# EAGLE design Radio Receiver (EAGLE 8.4.1)
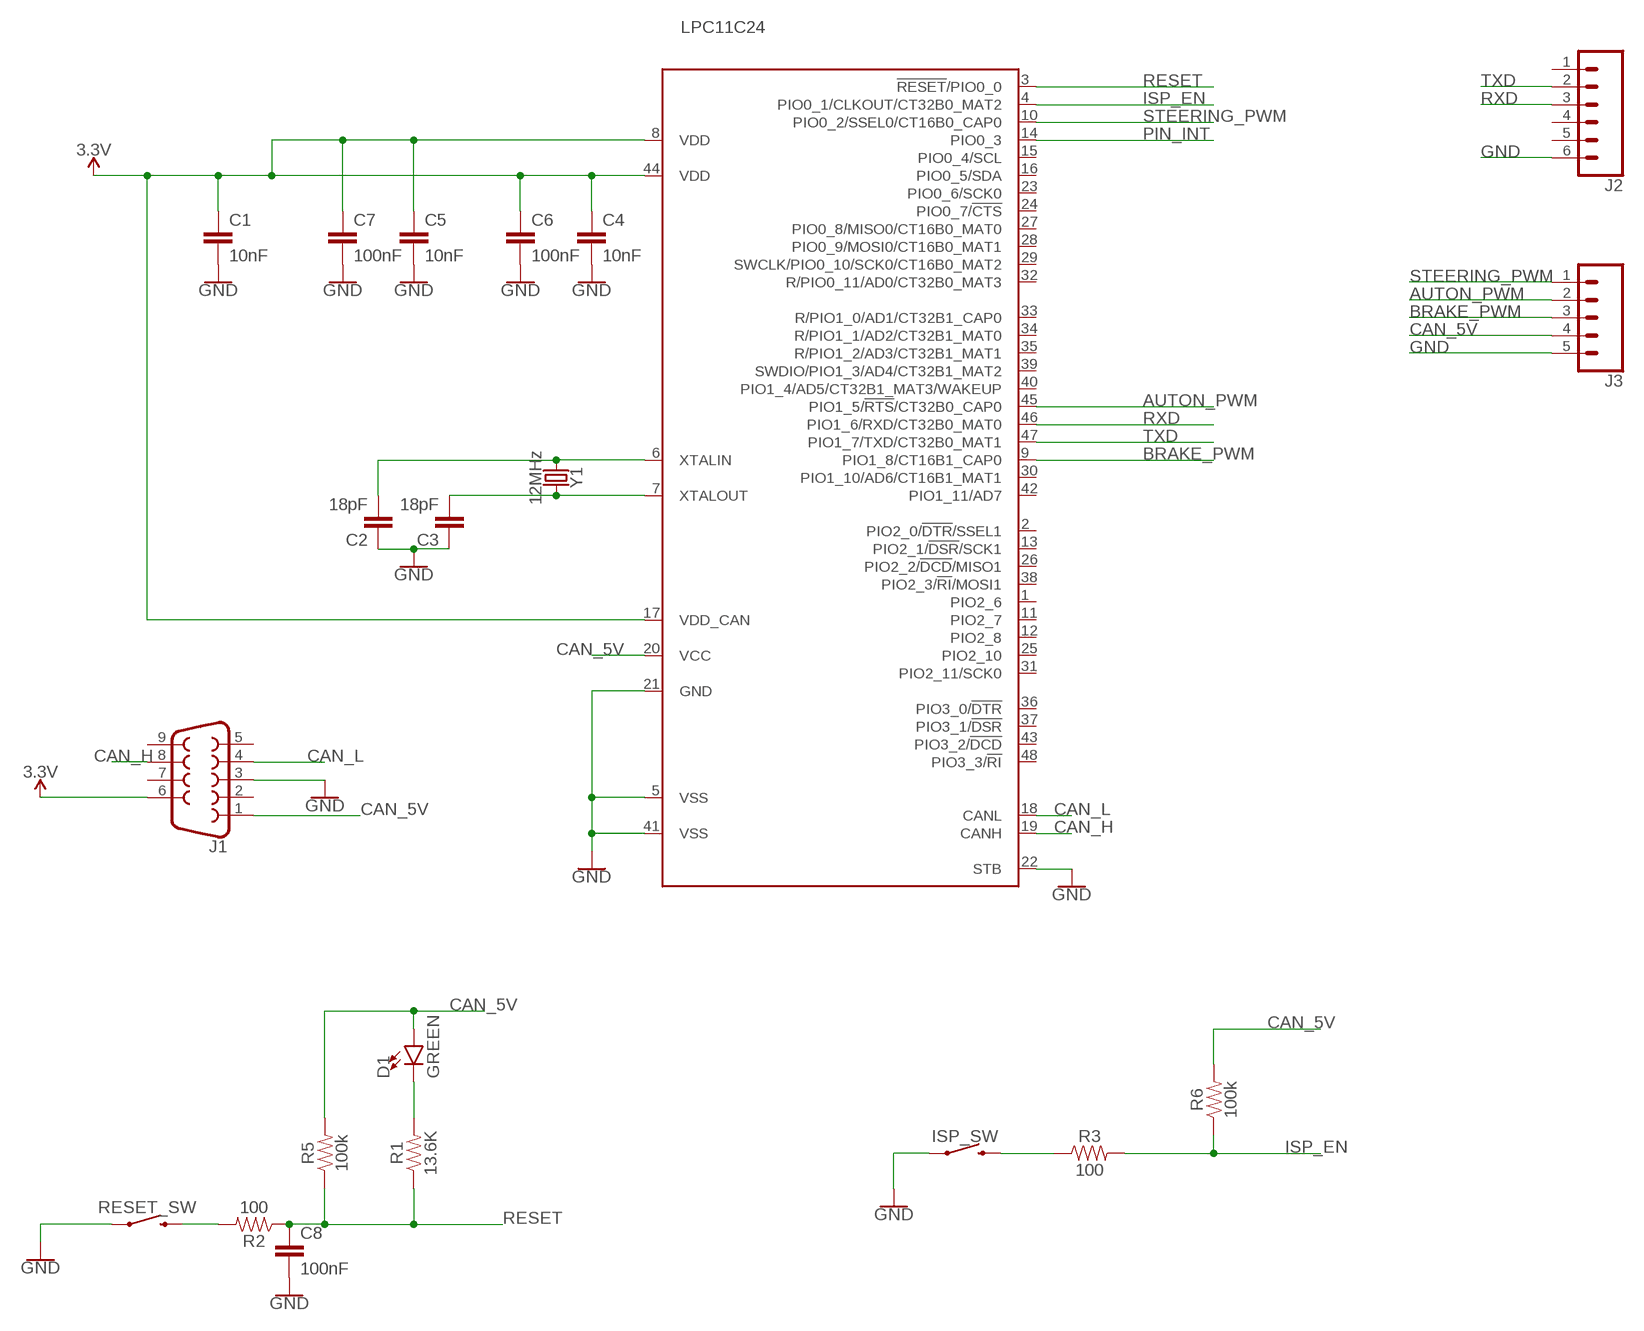
[diagram p0: schematic, sheet 1]

## Parts
C1  10nF  22PF-PTH-2.54MM-200V-5%  [CAP-PTH-2.54]
C2  18pF  22PF-PTH-2.54MM-200V-5%  [CAP-PTH-2.54]
C3  18pF  22PF-PTH-2.54MM-200V-5%  [CAP-PTH-2.54]
C4  10nF  22PF-PTH-2.54MM-200V-5%  [CAP-PTH-2.54]
C5  10nF  22PF-PTH-2.54MM-200V-5%  [CAP-PTH-2.54]
C6  100nF  22PF-PTH-2.54MM-200V-5%  [CAP-PTH-2.54]
C7  100nF  22PF-PTH-2.54MM-200V-5%  [CAP-PTH-2.54]
C8  100nF  22PF-PTH-2.54MM-200V-5%  [CAP-PTH-2.54]
D1  GREEN  LED-GREEN1206  [LED-1206]
ISP_SW  MOMENTARY-SWITCH-SPST-PTH-6.0MM  [TACTILE_SWITCH_PTH_6.0MM]
J1  DB9FEMALE  [DB9]
J2  CONN_06SILK_FEMALE_PTH  [1X06]
J3  CONN_05  [1X05]
LPC11C24  LPC11C22/24-LQFP48  [LQFP48]
R1  13.6K  100KOHM-HORIZ-1/4W-1%  [AXIAL-0.3]
R2  100  100KOHM-HORIZ-1/4W-1%  [AXIAL-0.3]
R3  100  100OHM-HORIZ-1/4W-1%  [AXIAL-0.3]
R5  100k  100KOHM-HORIZ-1/4W-1%  [AXIAL-0.3]
R6  100k  100KOHM-HORIZ-1/4W-1%  [AXIAL-0.3]
RESET_SW  MOMENTARY-SWITCH-SPST-PTH-6.0MM  [TACTILE_SWITCH_PTH_6.0MM]
Y1  12MHz  CRYSTAL-16MHZPTH-HC49US  [HC49US]

## Nets
3.3V: C1.1 C4.1 C5.1 C6.1 C7.1 J1.6 LPC11C24.8(VDD) LPC11C24.17(VDD_CAN) LPC11C24.44(VDD)
AUTON_PWM: J3.2 LPC11C24.45(PIO1_5/!RTS!/CT32B0_CAP0)
BRAKE_PWM: J3.3 LPC11C24.9(PIO1_8/CT16B1_CAP0)
CAN_5V: D1.A J1.1 J3.4 LPC11C24.20(VCC) R5.P$2 R6.P$2
CAN_H: J1.8 LPC11C24.19(CANH)
CAN_L: J1.4 LPC11C24.18(CANL)
GND: C1.2 C2.1 C3.1 C4.2 C5.2 C6.2 C7.2 C8.2 ISP_SW.1 J1.3 J2.6 J3.5 LPC11C24.5(VSS) LPC11C24.21(GND) LPC11C24.22(STB) LPC11C24.41(VSS) RESET_SW.1
ISP_EN: LPC11C24.4(PIO0_1/CLKOUT/CT32B0_MAT2) R3.P$2 R6.P$1
N$1: D1.C R1.P$2
N$2: R2.P$2 RESET_SW.3
N$4: ISP_SW.3 R3.P$1
PIN_INT: LPC11C24.14(PIO0_3)
RESET: C8.1 LPC11C24.3(!RESET!/PIO0_0) R1.P$1 R2.P$1 R5.P$1
RXD: J2.3 LPC11C24.46(PIO1_6/RXD/CT32B0_MAT0)
STEERING_PWM: J3.1 LPC11C24.10(PIO0_2/SSEL0/CT16B0_CAP0)
TXD: J2.2 LPC11C24.47(PIO1_7/TXD/CT32B0_MAT1)
XTALIN: C2.2 LPC11C24.6(XTALIN) Y1.1
XTALOUT: C3.2 LPC11C24.7(XTALOUT) Y1.2
Unconnected: J1.2 J1.5 J1.7 J1.9 J2.1 J2.4 J2.5 LPC11C24.1(PIO2_6) LPC11C24.2(PIO2_0/!DTR!/SSEL1) LPC11C24.11(PIO2_7) LPC11C24.12(PIO2_8) LPC11C24.13(PIO2_1/!DSR!/SCK1) LPC11C24.15(PIO0_4/SCL) LPC11C24.16(PIO0_5/SDA) LPC11C24.23(PIO0_6/SCK0) LPC11C24.24(PIO0_7/!CTS!) LPC11C24.25(PIO2_10) LPC11C24.26(PIO2_2/!DCD!/MISO1) LPC11C24.27(PIO0_8/MISO0/CT16B0_MAT0) LPC11C24.28(PIO0_9/MOSI0/CT16B0_MAT1) LPC11C24.29(SWCLK/PIO0_10/SCK0/CT16B0_MAT2) LPC11C24.30(PIO1_10/AD6/CT16B1_MAT1) LPC11C24.31(PIO2_11/SCK0) LPC11C24.32(R/PIO0_11/AD0/CT32B0_MAT3) LPC11C24.33(R/PIO1_0/AD1/CT32B1_CAP0) LPC11C24.34(R/PIO1_1/AD2/CT32B1_MAT0) LPC11C24.35(R/PIO1_2/AD3/CT32B1_MAT1) LPC11C24.36(PIO3_0/!DTR!) LPC11C24.37(PIO3_1/!DSR!) LPC11C24.38(PIO2_3/!RI!/MOSI1) LPC11C24.39(SWDIO/PIO1_3/AD4/CT32B1_MAT2) LPC11C24.40(PIO1_4/AD5/CT32B1_MAT3/WAKEUP) LPC11C24.42(PIO1_11/AD7) LPC11C24.43(PIO3_2/!DCD!) LPC11C24.48(PIO3_3/!RI!)

## Library data of the parts
C1-C8 = SparkFun-Capacitors:22PF: 22pF ceramic capacitors A capacitor is a passive two-terminal electrical component used to store electrical energy temporarily in an electric field.; PROD_ID: CAP-09128; VALUE: 22pF
D1 = SparkFun-LED:LED-GREEN: Green SMD LED Used in manufacturing of various products at SparkFun Packages: 0603 - SMD 0603 package [Product Link] <http://www.futureelectronics.com/en/technologies/semiconductors/optoelectronics/leds/Pages/9894312-LTST-C190GKT.aspx?CrossPart=HSMG-C190&IM=0> LilyPad 1206 - SMD1206 LilyPad package [Product Link] <http://www.futureelectronics.com/en/Technologies/Product.aspx?ProductID=IN150NGHARVATEKCORPORATION2049943&IM=0> 1206 - SMD1206 package [Product Link] <http://www.futureelectronics.com/en/technologies/semiconductors/optoelectronics/leds/Pages/8315665-LTST-C150KGKT.aspx?IM=0> 1206 Bottom Mount -SMD 1206 Bottom Mount [Product Link] <http://www.digikey.com/product-detail/en/lite-on-inc/LTST-C230KGKT/160-1456-1-ND/386854> SparkFun Products: Pro Mini 328 -5V <https://www.sparkfun.com/products/821> RedBoard <https://www.sparkfun.com/products/12757> MP3 Trigger <https://www.sparkfun.com/products/13720> Makey Makey <https://www.sparkfun.com/products/11076>; PROD_ID: DIO-00862
ISP_SW RESET_SW = SparkFun-Switches:MOMENTARY-SWITCH-SPST: Momentary Switch (Pushbutton) - SPST Normally-open (NO) SPST momentary switches (buttons, pushbuttons). Variants PTH-12MM - 12mm square, through-hole Momentary Pushbutton Switch - 12mm Square <https://www.sparkfun.com/products/9190> (COM-09190) PTH-6.0MM, PTH-6.0MM-KIT - 6.0mm square, through-hole Mini Pushbutton Switch <https://www.sparkfun.com/products/97> (COM-00097) KIT package intended for soldering kit's - only one side of pads' copper is exposed. PTH-RIGHT-ANGLE-KIT - Right-angle, through-hole Right Angle Tactile Button <https://www.sparkfun.com/products/10791> - Used on SparkFun BigTime Watch Kit <https://www.sparkfun.com/products/11734> SMD-12MM - 12mm square, surface-mount Tactile Button - SMD (12mm) <https://www.sparkfun.com/products/12993> (COM-12993) Used on SparkFun PicoBoard <https://www.sparkfun.com/products/11888> SMD-4.5MM - 4.5mm Square Trackball Switch Used on SparkFun Blackberry Trackballer Breakout <https://www.sparkfun.com/products/13169> SMD-4.6MMX2.8MM - 4.60mm x 2.80mm, surface mount Used on SparkFun SAMD21 Mini Breakout <https://www.sparkfun.com/products/13664> SMD-5.2MM, SMD-5.2-REDUNDANT - 5.2mm square, surface-mount Mini Pushbutton Switch - SMD <https://www.sparkfun.com/products/8720> (COM-08720) Used on Arduino Pro Mini <https://www.sparkfun.com/products/11114> REDUNDANT package connects both switch circuits together SMD-6.0X3.5MM - 6.0 x 3.5mm, surface mount Momentary Reset Switch SMD <https://www.sparkfun.com/products/8229> (COM-08229) SMD-6.2MM-TALL - 6.2mm square, surface mount Tactile Button - SMD (6mm) <https://www.sparkfun.com/products/12992> Used on SparkFun Digital Sandbox <https://www.sparkfun.com/products/12651> SMD-RIGHT-ANGLE - Right-angle, surface mount Used on SparkFun Block for Intel® Edison - Arduino <https://www.sparkfun.com/products/13036>; PROD_ID: SWCH-08441; SF_SKU: COM-00097
J1 = SparkFun-Connectors:DB9: DB9 Connector Standard DB9 (D-Sub 9) serial connector. Can be used for CAN bus as well as RS485 and RS232. Footprint production proven. Here is the female version connector we sell at SparkFun: 9 Pin Female Serial Connector - PCB Mount <https://www.sparkfun.com/products/429> (PRT-00429) This connector has been used on the following SparkFun products: SparkFun RS232 Shifter - SMD <https://www.sparkfun.com/products/449> (PRT-00449) SparkFun RS232 Shifter SMD (No DB9) <https://www.sparkfun.com/products/8780> (PRT-08780); PROD_ID: CONN-08194
J2 = SparkFun-Connectors:CONN_06: Multi connection point. Often used as Generic Header-pin footprint for 0.1 inch spaced/style header connections On any of the 0.1 inch spaced packages, you can populate with these: Break Away Headers - Straight <https://www.sparkfun.com/products/116> (PRT-00116) Break Away Male Headers - Right Angle <https://www.sparkfun.com/products/553> (PRT-00553) Female Headers <https://www.sparkfun.com/products/115> (PRT-00115) Break Away Headers - Machine Pin <https://www.sparkfun.com/products/117> (PRT-00117) Break Away Female Headers - Swiss Machine Pin <https://www.sparkfun.com/products/743> (PRT-00743) Arduino Stackable Header - 6 Pin <https://www.sparkfun.com/products/9280> (PRT-09280) For SCREWTERMINALS and SPRING TERMINALS visit here: Screw Terimnals on SparkFun.com <https://www.sparkfun.com/search/results?term=Screw+Terminals> (5mm/3.5mm/2.54mm spacing) This device is also useful as a general connection point to wire up your design to another part of your project. Our various solder wires solder well into these plated through hole pads. Hook-Up Wire - Assortment (Stranded, 22 AWG) <https://www.sparkfun.com/products/11375> (PRT-11375) Hook-Up Wire - Assortment (Solid Core, 22 AWG) <https://www.sparkfun.com/products/11367> (PRT-11367) View the entire wire category on our website here <https://www.sparkfun.com/categories/141>; PROD_ID: CONN-08437
J3 = SparkFun-Connectors:CONN_05: Multi connection point. Often used as Generic Header-pin footprint for 0.1 inch spaced/style header connections On any of the 0.1 inch spaced packages, you can populate with these: Break Away Headers - Straight <https://www.sparkfun.com/products/116> (PRT-00116) Break Away Male Headers - Right Angle <https://www.sparkfun.com/products/553> (PRT-00553) Female Headers <https://www.sparkfun.com/products/115> (PRT-00115) Break Away Headers - Machine Pin <https://www.sparkfun.com/products/117> (PRT-00117) Break Away Female Headers - Swiss Machine Pin <https://www.sparkfun.com/products/743> (PRT-00743) For SCREWTERMINALS and SPRING TERMINALS visit here: Screw Terimnals on SparkFun.com <https://www.sparkfun.com/search/results?term=Screw+Terminals> (5mm/3.5mm/2.54mm spacing) This device is also useful as a general connection point to wire up your design to another part of your project. Our various solder wires solder well into these plated through hole pads. Hook-Up Wire - Assortment (Stranded, 22 AWG) <https://www.sparkfun.com/products/11375> (PRT-11375) Hook-Up Wire - Assortment (Solid Core, 22 AWG) <https://www.sparkfun.com/products/11367> (PRT-11367) View the entire wire category on our website here <https://www.sparkfun.com/categories/141> Special notes: Molex polarized connector foot print use with SKU : PRT-08231 with associated crimp pins and housings. 1MM SMD Version SKU: PRT-10208
LPC11C24 = lpc1100v1.1:LPC11C22/24-LQFP48: NXP Semiconductors LPC11Cxx microcontrollers <http://ics.nxp.com/products/lpc1000/lpc11xx/lpc11cxx/> ARM 32-bit Cortex-M0 Microcontroller with MPU CPU clock up to 50MHz 32KByte on-chip Flash ROM with In-System Programming (ISP) and In-Application Programming (IAP) via On-Chip Bootloader 8KByte SRAM Nested Vectored Interrupt Controller 2 SPI controllers CAN controller On-chip, high-speed CAN transciever UART with full Modem Interface and RS485 Support Fast Mode I2C-Bus 4 Timers with 4 capture channels and 12 output channels Watchdog (WDT) Sytem tick timer 10-bit ADC with 8 channels Power Management Unit (PMU) Brownout detection 12MHz internal RC oscillator Serial Wire Debug/Trace port
R1 R2 = SparkFun-Resistors:100KOHM: 100kΩ resistor A resistor is a passive two-terminal electrical component that implements electrical resistance as a circuit element. Resistors act to reduce current flow, and, at the same time, act to lower voltage levels within circuits. - Wikipedia; PROD_ID: RES-12184; VALUE: 100k
R3 = SparkFun-Resistors:100OHM: 100Ω resistor A resistor is a passive two-terminal electrical component that implements electrical resistance as a circuit element. Resistors act to reduce current flow, and, at the same time, act to lower voltage levels within circuits. - Wikipedia; PROD_ID: RES-12181
R5 R6 = SparkFun-Resistors:100KOHM: 100kΩ resistor A resistor is a passive two-terminal electrical component that implements electrical resistance as a circuit element. Resistors act to reduce current flow, and, at the same time, act to lower voltage levels within circuits. - Wikipedia; PROD_ID: RES-12184
Y1 = SparkFun-Clocks:CRYSTAL-16MHZ: 16MHz Crystal Digikey Example <http://www.digikey.com/product-search/en?keywords=535-9122-1-ND> Frequency: 16MHz Frequency Stability: ±50ppm Frequency Tolerance: ±20ppm Load Capacitance: 18pF SparkFun Products: Pro Micro -5V/16MHz <https://www.sparkfun.com/products/12640> SparkFun Serial Enabled LCD Kit <https://www.sparkfun.com/products/10097>; PROD_ID: XTAL-08181; SF_ID: COM-00536; VALUE: 16MHz

## Board
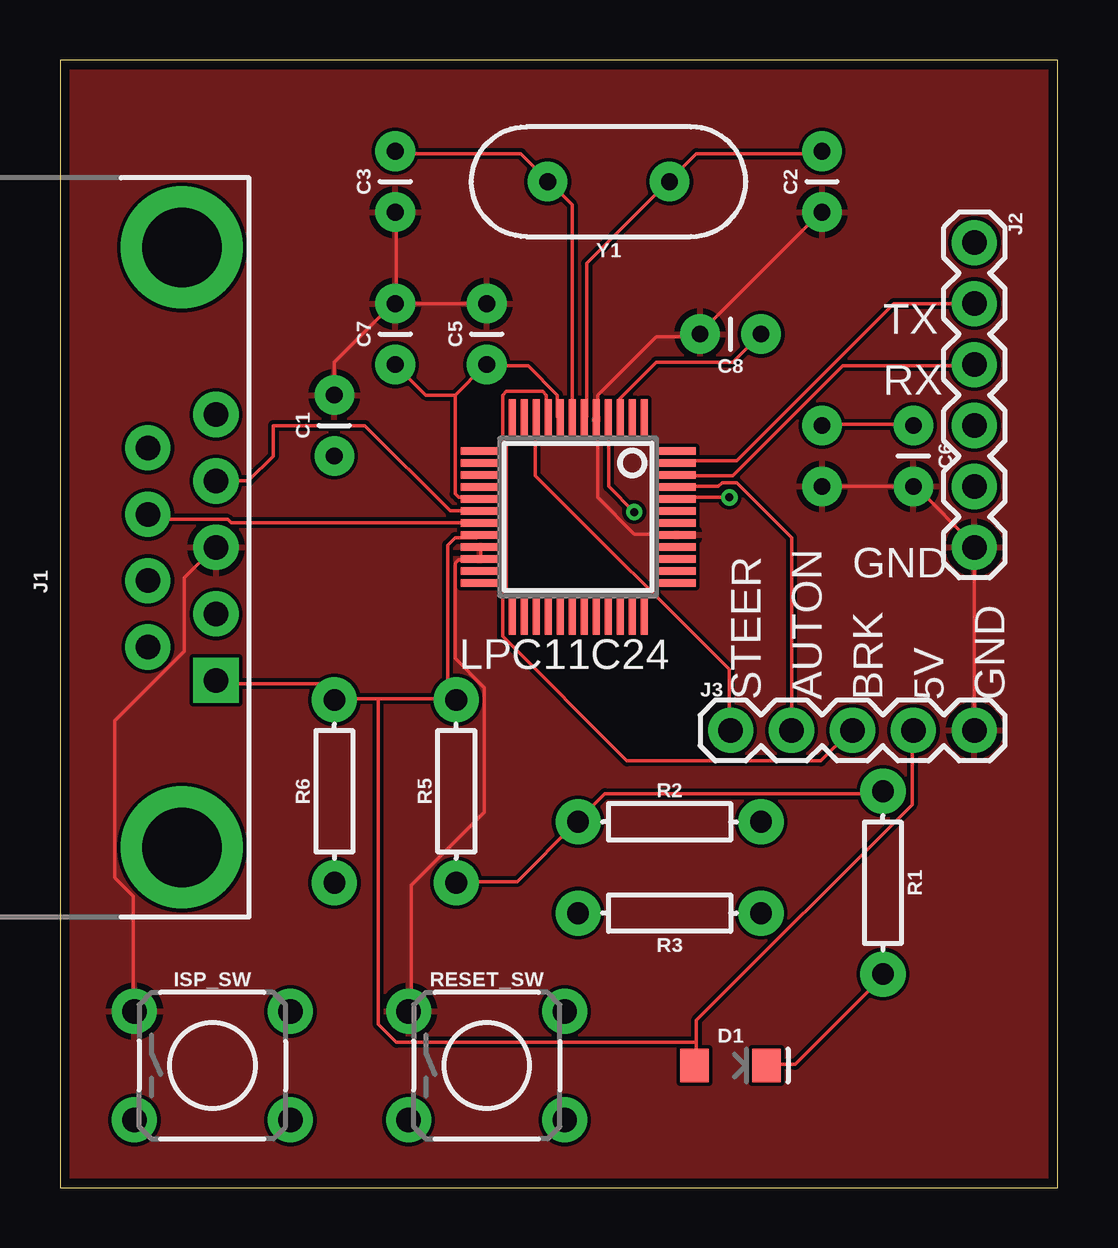
[diagram p1: board, top side]
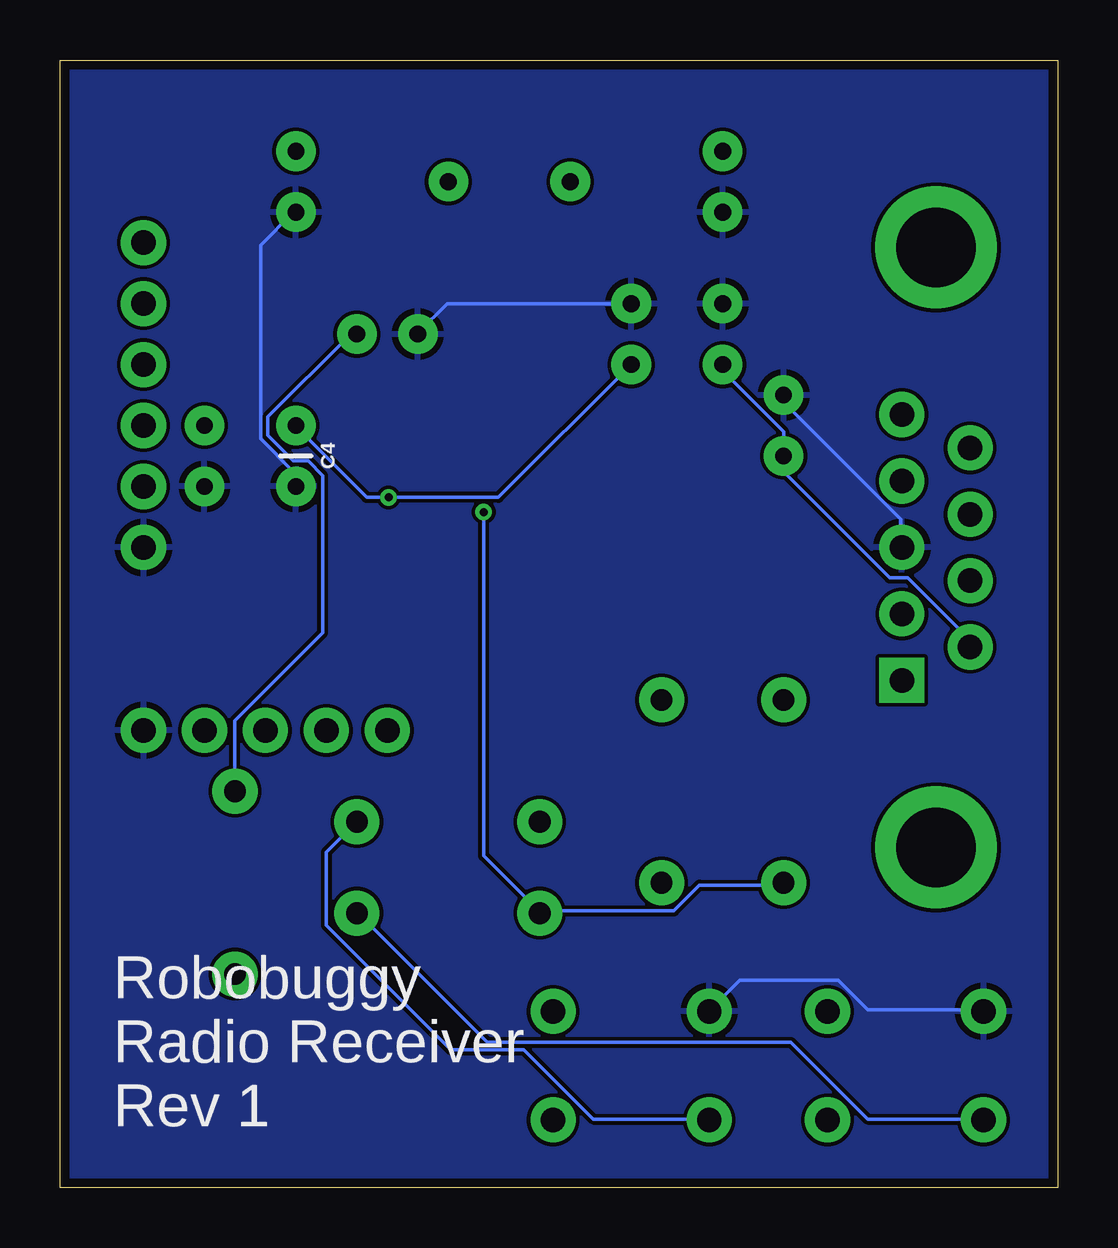
[diagram p2: board, bottom side, seen from below]

Size 41.58 x 46.98 mm. Coordinates in mm from the lower left corner, seen from the top.
Outline: 0,0 41.58,0 41.58,46.98 0,46.98 0,0
Copper layers (1*16): Top 0.0356mm / dielectric 1.5011mm / Bottom 0.0356mm
Design rules "oshpark-2layer": minimum track width 6mil, minimum drill 13mil, track to track 6mil, track to pad 6mil, pad to pad 6mil, via to via 6mil, smd to smd 6mil, copper to edge 15mil, drill to drill 6mil, minimum pad ring 7mil, minimum via ring 7mil, stop-mask expansion 2.5mil, vias tented up to drill 0mil, thermal gap 10mil

### Footprints (pad centres in the part's own frame; a part is rotated, then mirrored left to right if it is on the bottom)
CAP-PTH-2.54 = drill 0.7 pad 1.651: 1 -1.27,0; 2 1.27,0
LED-1206 = smd 1.2 x 1.4: A -1.5,0; C 1.5,0
TACTILE_SWITCH_PTH_6.0MM = drill 1.016 pad 1.88: 1 -3.251,2.261; 2 3.251,2.261; 3 -3.251,-2.261; 4 3.251,-2.261
DB9 = drill 1.016 pad 1.88 square: 1 -5.54,-1.42 | drill 1.016 pad 1.88: 2 -2.77,-1.42; 3 0,-1.42; 4 2.77,-1.42; 5 5.54,-1.42; 6 -4.15,1.42; 7 -1.38,1.42; 8 1.38,1.42; 9 4.15,1.42 | drill 3.302 pad 5.08: G1 -12.5,0; G2 12.5,0
1X06 = drill 1.016 pad 1.88: 1 0,0; 2 2.54,0; 3 5.08,0; 4 7.62,0; 5 10.16,0; 6 12.7,0
1X05 = drill 1.016 pad 1.88: 1 0,0; 2 2.54,0; 3 5.08,0; 4 7.62,0; 5 10.16,0
LQFP48 = smd 0.3 x 1.6: 1 -2.75,-4.1; 2 -2.25,-4.1; 3 -1.75,-4.1; 4 -1.25,-4.1; 5 -0.75,-4.1; 6 -0.25,-4.1; 7 0.25,-4.1; 8 0.75,-4.1; 9 1.25,-4.1; 10 1.75,-4.1; 11 2.25,-4.1; 12 2.75,-4.1; 25 2.75,4.1; 26 2.25,4.1; 27 1.75,4.1; 28 1.25,4.1; 29 0.75,4.1; 30 0.25,4.1; 31 -0.25,4.1; 32 -0.75,4.1; 33 -1.25,4.1; 34 -1.75,4.1; 35 -2.25,4.1; 36 -2.75,4.1 | smd 1.6 x 0.3: 13 4.1,-2.75; 14 4.1,-2.25; 15 4.1,-1.75; 16 4.1,-1.25; 17 4.1,-0.75; 18 4.1,-0.25; 19 4.1,0.25; 20 4.1,0.75; 21 4.1,1.25; 22 4.1,1.75; 23 4.1,2.25; 24 4.1,2.75; 37 -4.1,2.75; 38 -4.1,2.25; 39 -4.1,1.75; 40 -4.1,1.25; 41 -4.1,0.75; 42 -4.1,0.25; 43 -4.1,-0.25; 44 -4.1,-0.75; 45 -4.1,-1.25; 46 -4.1,-1.75; 47 -4.1,-2.25; 48 -4.1,-2.75
AXIAL-0.3 = drill 0.9 pad 1.88: P$1 -3.81,0; P$2 3.81,0
HC49US = drill 0.7 pad 1.651: 1 -2.54,0; 2 2.54,0

### Placement (x,y rotation side)
C1  11.43,31.75 90 top
C2  31.75,41.91 90 top
C3  13.97,41.91 90 top
C4  31.75,30.48 270 bottom
C5  17.78,35.56 90 top
C6  35.56,30.48 270 top
C7  13.97,35.56 90 top
C8  27.94,35.56 180 top
D1  27.94,5.08 0 top
ISP_SW  6.35,5.08 0 top
J1  5.08,26.67 90 top
J2  38.1,39.37 270 top
J3  27.94,19.05 0 top
LPC11C24  21.59,27.94 180 top
R1  34.29,12.7 270 top
R2  25.4,15.24 0 top
R3  25.4,11.43 180 top
R5  16.51,16.51 90 top
R6  11.43,16.51 90 top
RESET_SW  17.78,5.08 0 top
Y1  22.86,41.91 180 top

### Tracks (layer width: path | path; a pad name or v marks a point on that pad's centre or on a via)
3.3V  (via drill 0.33)
  Top 0.152: v27.89,28.75 25.76,28.75 LPC11C24.44 | C6.1 35.51,31.8 31.85,31.8 C4.1 | 16.46,33.02 16.46,28.9 16.61,28.75 17.37,28.75 LPC11C24.17 | 16.46,33.02 17.68,34.24 C5.1 17.83,34.24 19.51,34.24 20.73,33.02 20.73,32.11 LPC11C24.8 | 16.46,33.02 15.24,33.02 C7.1
  Bottom 0.152: C4.1 31.7,31.65 28.8,28.75 v27.89,28.75 23.32,28.75 C5.1 | C7.1 13.87,34.24 13.87,33.93 11.43,31.5 C1.1 11.43,29.82 7.01,25.4 6.25,25.4 3.81,22.96 3.81,22.66 J1.6
AUTON_PWM
  Top 0.152: J3.2 30.48,27.08 28.19,29.36 27.58,29.36 27.43,29.21 25.76,29.21 LPC11C24.45
BRAKE_PWM
  Top 0.152: LPC11C24.9 20.27,32.11 20.27,33.02 20.12,33.17 18.59,33.17 18.44,33.02 18.44,31.04 18.59,30.89 18.59,24.94 18.44,24.79 18.44,22.96 23.62,17.78 31.7,17.78 32.92,19 J3.3
CAN_5V
  Top 0.152: 16.15,20.68 16.15,26.77 16.46,27.08 17.37,27.08 LPC11C24.20 | 16.15,20.68 R5.P$2 16.46,20.37 | 13.26,20.37 15.85,20.37 16.15,20.68 | 13.26,20.37 11.43,20.37 | 11.43,20.37 10.82,20.98 6.55,20.98 J1.1 | 11.43,20.37 R6.P$2 | 26.52,6.04 26.52,6.96 35.51,15.95 35.51,19 J3.4 | 26.52,6.04 26.52,5.13 D1.A | 13.26,20.37 13.26,6.81 14.02,6.04 26.52,6.04
CAN_H
  Top 0.152: LPC11C24.19 7.13,27.69 6.98,27.84 3.87,27.84 J1.8
CAN_L
  Top 0.152: LPC11C24.18 16.26,28.19 12.7,31.75 8.89,31.75 8.89,30.48 7.85,29.44 J1.4
GND
  Top 0.152: LPC11C24.21 17.53,26.62 17.53,26.31 LPC11C24.22 17.37,26.16 16.61,26.16 16.46,26.01 16.46,22.05 17.68,20.83 17.68,15.65 14.63,12.6 14.63,7.42 RESET_SW.1 | C1.2 11.43,34.39 13.87,36.83 C7.2 14.02,36.83 | 14.02,36.83 14.02,40.64 C3.1 | 14.02,36.83 C5.2 | C4.2 C6.2 35.66,29.21 38.1,26.77 J2.6 J3.5 | LPC11C24.41 25.6,27.23 23.93,27.23 22.4,28.75 22.4,31.95 LPC11C24.5 22.4,32.11 22.4,33.02 24.84,35.46 26.67,35.46 C8.2 26.67,35.61 31.7,40.64 C2.1 | ISP_SW.1 3.05,7.42 3.05,12.14 2.29,12.9 2.29,19.46 5.18,22.35 5.18,25.4 6.4,26.62 J1.3
  Bottom 0.152: ISP_SW.1 3.2,7.42 7.92,7.42 9.14,8.64 13.26,8.64 14.48,7.42 RESET_SW.1 | C1.2 11.43,32.72 6.55,27.84 6.55,26.77 J1.3 | C4.2 31.85,29.21 31.85,29.82 33.22,31.19 33.22,39.27 31.85,40.64 C2.1 | C5.2 25.45,36.83 26.67,35.61 C8.2
  pour Top: 0,46.99 41.91,46.99 41.91,0 0,0
  pour Bottom: 0,46.99 41.91,46.99 41.91,0 0,0
ISP_EN  (via drill 0.33)
  Top 0.152: v23.93,28.14 22.86,29.21 22.86,31.95 LPC11C24.4
  Bottom 0.152: v23.93,28.14 23.93,13.82 21.64,11.53 R3.P$2 21.49,11.53 16,11.53 14.94,12.6 11.43,12.6 R6.P$1
N$1
  Top 0.152: D1.C 29.57,5.13 30.63,5.13 34.29,8.79 R1.P$2
N$2
  Bottom 0.152: R2.P$2 30.48,13.97 30.48,10.92 25.3,5.74 22.25,5.74 19.36,2.84 14.63,2.84 RESET_SW.3
N$4
  Bottom 0.152: ISP_SW.3 3.2,2.84 7.92,2.84 11.12,6.04 23.77,6.04 29.11,11.38 R3.P$1
RESET
  Top 0.152: C8.1 28.04,34.39 24.84,34.39 23.32,32.87 23.32,32.11 LPC11C24.3 | R5.P$1 16.61,12.75 19.05,12.75 21.49,15.19 R2.P$1 21.64,15.34 22.71,16.41 34.29,16.41 R1.P$1
  Bottom 0.152: R1.P$1 34.29,19.46 30.63,23.11 30.63,29.67 31.24,30.28 31.85,30.28 32.92,31.34 32.92,32.11 29.57,35.46 29.26,35.46 C8.1
RXD
  Top 0.152: LPC11C24.46 25.76,29.67 28.04,29.67 32.61,34.24 38.1,34.24 J2.3
STEERING_PWM
  Top 0.152: LPC11C24.10 19.81,31.95 19.81,29.67 27.89,21.59 27.89,19.15 J3.1
TXD
  Top 0.152: J2.2 34.75,36.83 28.19,30.28 25.76,30.28 LPC11C24.47
XTALIN
  Top 0.152: LPC11C24.6 21.95,32.11 21.95,38.51 25.3,41.86 Y1.1 25.45,42.01 26.52,43.08 31.7,43.08 C2.2
XTALOUT
  Top 0.152: LPC11C24.7 21.34,32.11 21.34,40.94 20.42,41.86 Y1.2 20.27,42.01 19.2,43.08 14.02,43.08 C3.2

### Text on the board
tNames: TX | RX | GND | STEER | AUTON | BRK | 5V | GND
bNames: Robobuggy / Radio Receiver / Rev 1